# Altium project stm32board.PrjPcb
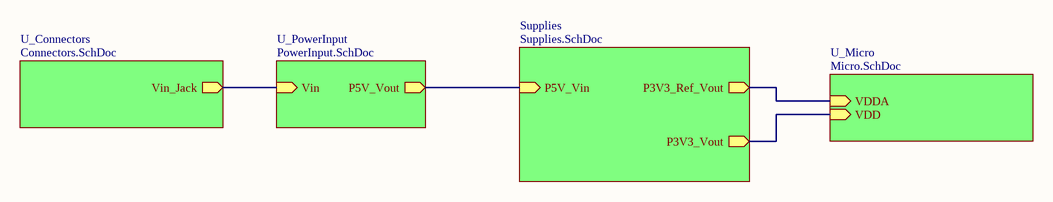
[diagram p0: TopLevel.SchDoc]
5 sheets, 20 parts. Net scope: hierarchical (ports join the sheet entries above them; power ports are global).
Board file: Board_Single.PcbDoc
Sheets:
  TopLevel.SchDoc
    Supplies = Supplies.SchDoc
    U_Micro = Micro.SchDoc
    U_Connectors = Connectors.SchDoc
    U_PowerInput = PowerInput.SchDoc

## Sheet TopLevel.SchDoc
size B; SheetNumber: 1; SheetTotal: 6

### Sub-sheets
Supplies = Supplies.SchDoc: P3V3_Ref_Vout (out), P3V3_Vout (out), P5V_Vin (in)
U_Connectors = Connectors.SchDoc: Vin_Jack (out)
U_Micro = Micro.SchDoc: VDDA (in), VDD (in)
U_PowerInput = PowerInput.SchDoc: P5V_Vout (out), Vin (in)

### Nets
P3V3: sheet Supplies/P3V3_Vout, sheet U_Micro/VDD
P3V3_Ref: sheet Supplies/P3V3_Ref_Vout, sheet U_Micro/VDDA
P5V: sheet Supplies/P5V_Vin, sheet U_PowerInput/P5V_Vout
Vin: sheet U_Connectors/Vin_Jack, sheet U_PowerInput/Vin

## Sheet Supplies.SchDoc
size A; SheetNumber: 2; SheetTotal: 4
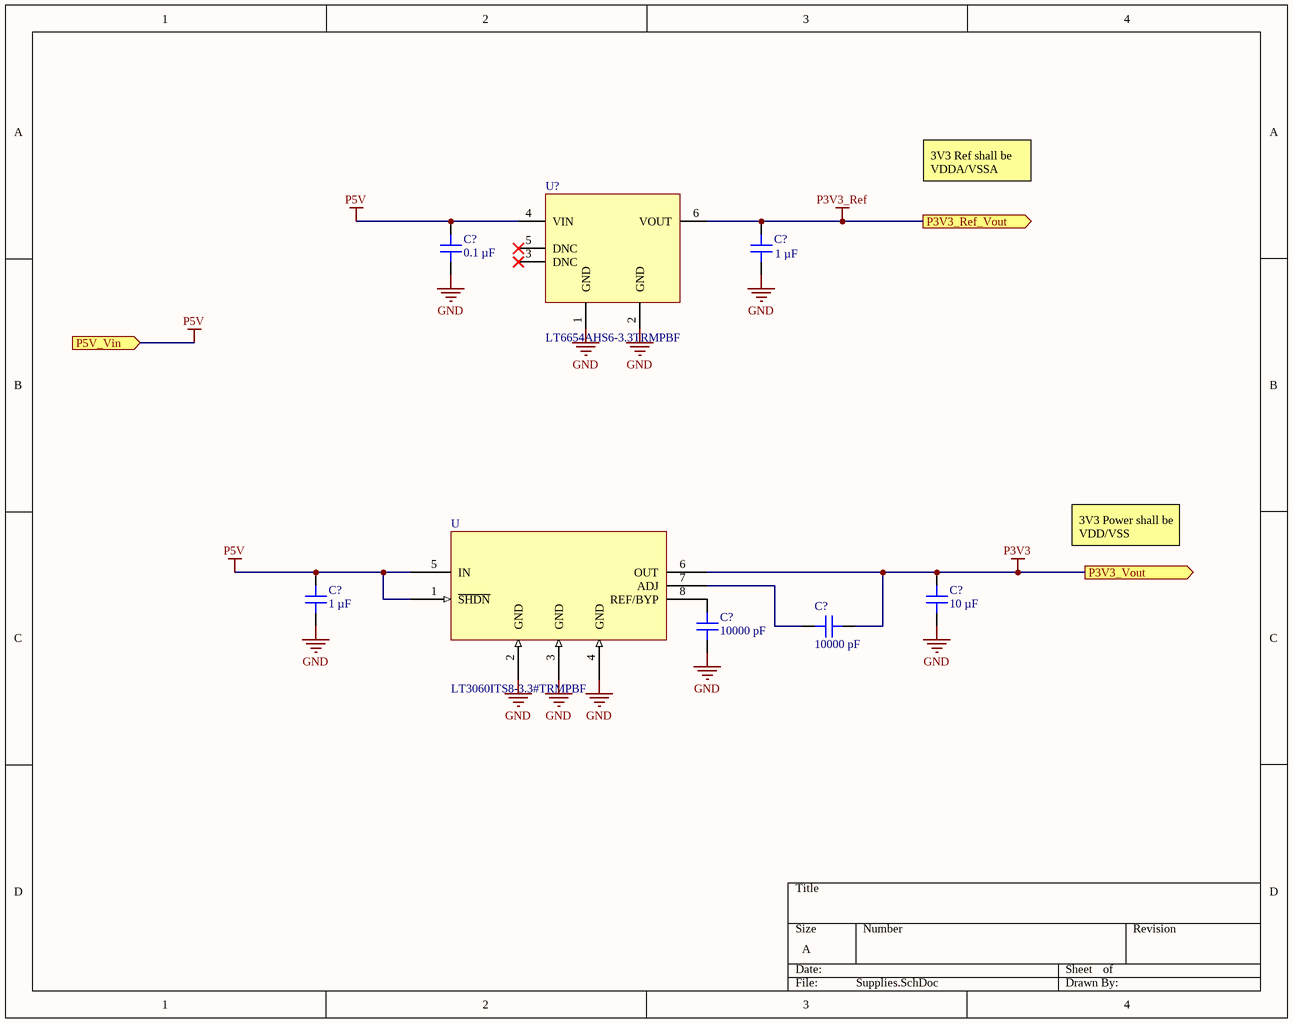
[diagram p1: Supplies.SchDoc]

### Parts
(Parts that share a designator on the sheet are numbered #1, #2 ... from top to bottom, then left to right.)
C?#1  0.1 µF  [CAP 0805_2012]
C?#2  1 µF  [CAP 0805_2012]
C?#3  1 µF  [CAP 0805_2012]
C?#4  10 µF  [CAP 1206_3216 - 0.8MM]
C?#5  10000 pF  [CAP 0805_2012]
C?#6  10000 pF  [CAP 0805_2012]
U  LT3060ITS8-3.3#TRMPBF  [TSOT-23_TS8]
U?  LT6654AHS6-3.3TRMPBF  [SOT95P280X100-6N]

### Ports
P3V3_Ref_Vout (out), P3V3_Vout (out), P5V_Vin (in)

### Nets
GND: C?#1.1 C?#2.1 C?#3.1 C?#4.1 C?#5.1 U.2(GND) U.3(GND) U.4(GND) U?.1(GND) U?.2(GND)
P3V3: C?#4.2 C?#6.1 U.6(OUT) ; port P3V3_Vout
P3V3_Ref: C?#2.2 U?.6(VOUT) ; port P3V3_Ref_Vout
P5V: C?#1.2 C?#3.2 U.1(~{SHDN}) U.5(IN) U?.4(VIN) ; port P5V_Vin
NetC?#5_2: C?#5.2 U.8(REF/BYP)
NetC?#6_2: C?#6.2 U.7(ADJ)

Not connected (* = marked no-connect by the designer): U? 3(DNC)* 5(DNC)*

### Notes on the sheet
- 3V3 Ref shall be VDDA/VSSA
- 3V3 Power shall be VDD/VSS

### Library data of the parts
C?#1 = C0805C104M3RAC7800: CAP CER 0.1UF 25V X7R 0805; manufacturer: KEMET; Tolerance: ±20%; Part Number: C0805C104M3RAC7800; Value: 0.1 µF; Applications: Bypass, Decoupling; Capacitance: 0.1 µF; componentlink1description: Datasheet; componentlink1url: https://api.kemet.com/component-edge/download/datasheet/C0805C104M3RACTU.pdf; componentlink2description: DigiKey Link; componentlink2url: https://www.digikey.com/en/products/detail/kemet/C0805C104M3RAC7800/2211748; Device Package: 0805 (2012 Metric); lastupdated: 8/21/2023 7:11:38 PM; Lifecycle Status: Active; Minimum Order: 1; Mounting Type: Surface Mount, MLCC; Operating Temperature: -55°C ~ 125°C; Package / Case: 0805 (2012 Metric); packaging: TapeAndReel; partid: 32959; Part Status: Active; price: 0.01; series: SMD Comm X7R; Size / Dimension: 0.079" L x 0.049" W (2.00mm x 1.25mm); Supplier 1: DigiKey; Supplier Part Number 1: 399-C0805C104M3RAC7800CT-ND; Temperature Coefficient: X7R; Thickness (Max): 0.035" (0.88mm); Voltage - Rated: 25V
C?#2 C?#3 = C0805C105M3RAC7800: CAP CER 1UF 25V X7R 0805; manufacturer: KEMET; Tolerance: ±20%; Part Number: C0805C105M3RAC7800; Value: 1 µF; Applications: Bypass, Decoupling; Capacitance: 1 µF; componentlink1description: Datasheet; componentlink1url: https://api.kemet.com/component-edge/download/datasheet/C0805C105M3RACTU.pdf; componentlink2description: DigiKey Link; componentlink2url: https://www.digikey.com/en/products/detail/kemet/C0805C105M3RAC7800/2211774; Device Package: 0805 (2012 Metric); lastupdated: 8/21/2023 7:11:38 PM; Lifecycle Status: Active; Minimum Order: 1; Mounting Type: Surface Mount, MLCC; Operating Temperature: -55°C ~ 125°C; Package / Case: 0805 (2012 Metric); packaging: TapeAndReel; partid: 32957; Part Status: Active; price: 0.02; series: SMD Comm X7R; Size / Dimension: 0.079" L x 0.049" W (2.00mm x 1.25mm); Supplier 1: DigiKey; Supplier Part Number 1: 399-C0805C105M3RAC7800CT-ND; Temperature Coefficient: X7R; Thickness (Max): 0.057" (1.45mm); Voltage - Rated: 25V
C?#4 = C1206C106M4RAC7800: CAP CER 10UF 16V X7R 1206; manufacturer: KEMET; Tolerance: ±20%; Part Number: C1206C106M4RAC7800; Value: 10 µF; Applications: Bypass, Decoupling; Capacitance: 10 µF; componentlink1description: Datasheet; componentlink1url: https://connect.kemet.com:7667/gateway/IntelliData-ComponentDocumentation/1.0/download/datasheet/C1206C106M4RACTU; componentlink2description: DigiKey Link; componentlink2url: https://www.digikey.com/en/products/detail/kemet/C1206C106M4RAC7800/1090844; Device Package: 1206 (3216 Metric); lastupdated: 8/21/2023 7:14:59 PM; Lifecycle Status: Active; Minimum Order: 1; Mounting Type: Surface Mount, MLCC; Operating Temperature: -55°C ~ 125°C; Package / Case: 1206 (3216 Metric); packaging: TapeAndReel; partid: 45390; Part Status: Active; price: 0.09; series: SMD Comm X7R; Size / Dimension: 0.126" L x 0.063" W (3.20mm x 1.60mm); Supplier 1: DigiKey; Supplier Part Number 1: 399-C1206C106M4RAC7800CT-ND; Temperature Coefficient: X7R; Thickness (Max): 0.071" (1.80mm); Voltage - Rated: 16V
C?#5 C?#6 = C0805C103M3RAC7800: CAP CER 10000PF 25V X7R 0805; manufacturer: KEMET; Tolerance: ±20%; Part Number: C0805C103M3RAC7800; Value: 10000 pF; Applications: Bypass, Decoupling; Capacitance: 10000 pF; componentlink1description: Datasheet; componentlink1url: https://api.kemet.com/component-edge/download/datasheet/C0805C103M3RACTU.pdf; componentlink2description: DigiKey Link; componentlink2url: https://www.digikey.com/en/products/detail/kemet/C0805C103M3RAC7800/2211730; Device Package: 0805 (2012 Metric); lastupdated: 8/21/2023 7:11:36 PM; Lifecycle Status: Active; Minimum Order: 1; Mounting Type: Surface Mount, MLCC; Operating Temperature: -55°C ~ 125°C; Package / Case: 0805 (2012 Metric); packaging: TapeAndReel; partid: 31983; Part Status: Active; price: 0.02; series: SMD Comm X7R; Size / Dimension: 0.079" L x 0.049" W (2.00mm x 1.25mm); Supplier 1: DigiKey; Supplier Part Number 1: 399-C0805C103M3RAC7800CT-ND; Temperature Coefficient: X7R; Thickness (Max): 0.035" (0.88mm); Voltage - Rated: 25V
U = LT3060ITS8-3.3#TRMPBF: LDO Regulator Pos 0.6V to 44.5V 0.1A Automotive 8-Pin TSOT-23 T/R; MP: LT3060HTS8#TRMPBF; MF: Analog Devices; Arrow_Electronics-Purchase-URL: https://snapeda.com/shop?store=Arrow+Electronics&id=4333210; Value: *; SnapEDA_Link: https://www.snapeda.com/parts/LT3060HTS8%23TRMPBF/Analog%20Devices/view-part/4333210/?ref=snap; Mouser-Purchase-URL: https://snapeda.com/shop?store=Mouser&id=4333210; Price: None; DigiKey-Purchase-URL: https://snapeda.com/shop?store=DigiKey&id=4333210; Package: SOT-23-8 Analog Devices; Availability: Unavailable
U? = LT6654AHS6-3.3TRMPBF: Precision Wide Supply High Output Drive Low Noise Reference; MF: Analog Devices; MP: LT6654AHS6-3.3#TRMPBF; SnapEDA_Link: https://www.snapeda.com/parts/LT6654AHS6-3.3%23TRMPBF/Analog+Devices/view-part/?ref=snap; Package: SOT-6 Analog Devices; Value: *; Check_prices: https://www.snapeda.com/parts/LT6654AHS6-3.3%23TRMPBF/Analog+Devices/view-part/?ref=eda

## Sheet Micro.SchDoc
size A; SheetNumber: 3; SheetTotal: 6
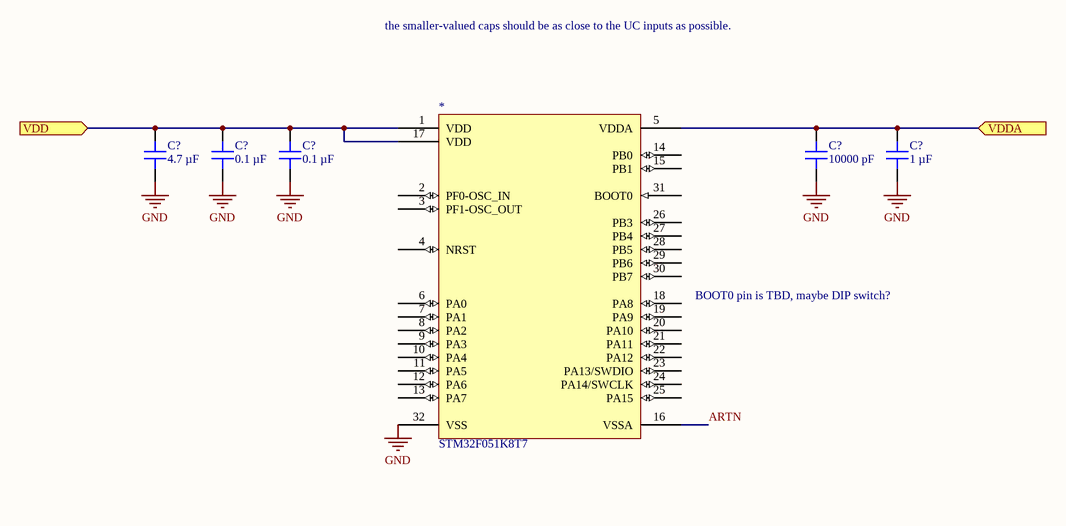
[diagram p2: Micro.SchDoc]

### Parts
(Parts that share a designator on the sheet are numbered #1, #2 ... from top to bottom, then left to right.)
*  STM32F051K8T7  [QFP80P900X900X160-32N]
C?#7  4.7 µF  [CAP 1206_3216 - 0.8MM]
C?#8  0.1 µF  [CAP 0805_2012]
C?#9  0.1 µF  [CAP 0805_2012]
C?#10  10000 pF  [CAP 0805_2012]
C?#11  1 µF  [CAP 0805_2012]

### Ports
VDD (in), VDDA (in)

### Nets
GND: *.32(VSS) C?#7.1 C?#8.1 C?#9.1 C?#10.1 C?#11.1
P3V3: *.1(VDD) *.17(VDD) C?#7.2 C?#8.2 C?#9.2 ; port VDD
P3V3_Ref: *.5(VDDA) C?#10.2 C?#11.2 ; port VDDA
ARTN: *.16(VSSA)

Not connected (* = marked no-connect by the designer): * 2(PF0-OSC_IN) 3(PF1-OSC_OUT) 4(NRST) 6(PA0) 7(PA1) 8(PA2) 9(PA3) 10(PA4) 11(PA5) 12(PA6) 13(PA7) 14(PB0) 15(PB1) 18(PA8) 19(PA9) 20(PA10) 21(PA11) 22(PA12) 23(PA13/SWDIO) 24(PA14/SWCLK) 25(PA15) 26(PB3) 27(PB4) 28(PB5) 29(PB6) 30(PB7) 31(BOOT0)

### Notes on the sheet
- the smaller-valued caps should be as close to the UC inputs as possible.
- BOOT0 pin is TBD, maybe DIP switch?

### Library data of the parts
C?#7 = C1206C475M3RAC7800: CAP CER 4.7UF 25V X7R 1206; manufacturer: KEMET; Tolerance: ±20%; Part Number: C1206C475M3RAC7800; Value: 4.7 µF; Applications: Bypass, Decoupling; Capacitance: 4.7 µF; componentlink1description: Datasheet; componentlink1url: https://api.kemet.com/component-edge/download/datasheet/C1206C475M3RACTU.pdf; componentlink2description: DigiKey Link; componentlink2url: https://www.digikey.com/en/products/detail/kemet/C1206C475M3RAC7800/2215998; Device Package: 1206 (3216 Metric); lastupdated: 8/22/2023 7:13:55 PM; Lifecycle Status: Active; Minimum Order: 1; Mounting Type: Surface Mount, MLCC; Operating Temperature: -55°C ~ 125°C; Package / Case: 1206 (3216 Metric); packaging: TapeAndReel; partid: 30483; Part Status: Active; price: 0.07; series: SMD Comm X7R; Size / Dimension: 0.126" L x 0.063" W (3.20mm x 1.60mm); Supplier 1: DigiKey; Supplier Part Number 1: 399-C1206C475M3RAC7800CT-ND; Temperature Coefficient: X7R; Thickness (Max): 0.071" (1.80mm); Voltage - Rated: 25V
C?#8 C?#9 = C0805C104M3RAC7800: as C?#1 on sheet Supplies; Part Number: C0805C104M3RAC7800; Value: 0.1 µF; Applications: Bypass, Decoupling; Capacitance: 0.1 µF; componentlink1description: Datasheet; componentlink1url: https://api.kemet.com/component-edge/download/datasheet/C0805C104M3RACTU.pdf; componentlink2description: DigiKey Link; componentlink2url: https://www.digikey.com/en/products/detail/kemet/C0805C104M3RAC7800/2211748; Device Package: 0805 (2012 Metric); lastupdated: 8/21/2023 7:11:38 PM; Lifecycle Status: Active; Minimum Order: 1; Mounting Type: Surface Mount, MLCC; Operating Temperature: -55°C ~ 125°C; Package / Case: 0805 (2012 Metric); packaging: TapeAndReel; partid: 32959; Part Status: Active; price: 0.01; series: SMD Comm X7R; Size / Dimension: 0.079" L x 0.049" W (2.00mm x 1.25mm); Supplier 1: DigiKey; Supplier Part Number 1: 399-C0805C104M3RAC7800CT-ND; Temperature Coefficient: X7R; Thickness (Max): 0.035" (0.88mm); Voltage - Rated: 25V
C?#10 = C0805C103M3RAC7800: as C?#5 on sheet Supplies; Part Number: C0805C103M3RAC7800; Value: 10000 pF; Applications: Bypass, Decoupling; Capacitance: 10000 pF; componentlink1description: Datasheet; componentlink1url: https://api.kemet.com/component-edge/download/datasheet/C0805C103M3RACTU.pdf; componentlink2description: DigiKey Link; componentlink2url: https://www.digikey.com/en/products/detail/kemet/C0805C103M3RAC7800/2211730; Device Package: 0805 (2012 Metric); lastupdated: 8/21/2023 7:11:36 PM; Lifecycle Status: Active; Minimum Order: 1; Mounting Type: Surface Mount, MLCC; Operating Temperature: -55°C ~ 125°C; Package / Case: 0805 (2012 Metric); packaging: TapeAndReel; partid: 31983; Part Status: Active; price: 0.02; series: SMD Comm X7R; Size / Dimension: 0.079" L x 0.049" W (2.00mm x 1.25mm); Supplier 1: DigiKey; Supplier Part Number 1: 399-C0805C103M3RAC7800CT-ND; Temperature Coefficient: X7R; Thickness (Max): 0.035" (0.88mm); Voltage - Rated: 25V
C?#11 = C0805C105M3RAC7800: as C?#2 on sheet Supplies; Part Number: C0805C105M3RAC7800; Value: 1 µF; Applications: Bypass, Decoupling; Capacitance: 1 µF; componentlink1description: Datasheet; componentlink1url: https://api.kemet.com/component-edge/download/datasheet/C0805C105M3RACTU.pdf; componentlink2description: DigiKey Link; componentlink2url: https://www.digikey.com/en/products/detail/kemet/C0805C105M3RAC7800/2211774; Device Package: 0805 (2012 Metric); lastupdated: 8/21/2023 7:11:38 PM; Lifecycle Status: Active; Minimum Order: 1; Mounting Type: Surface Mount, MLCC; Operating Temperature: -55°C ~ 125°C; Package / Case: 0805 (2012 Metric); packaging: TapeAndReel; partid: 32957; Part Status: Active; price: 0.02; series: SMD Comm X7R; Size / Dimension: 0.079" L x 0.049" W (2.00mm x 1.25mm); Supplier 1: DigiKey; Supplier Part Number 1: 399-C0805C105M3RAC7800CT-ND; Temperature Coefficient: X7R; Thickness (Max): 0.057" (1.45mm); Voltage - Rated: 25V

## Sheet Connectors.SchDoc
size A; SheetNumber: 4; SheetTotal: 6
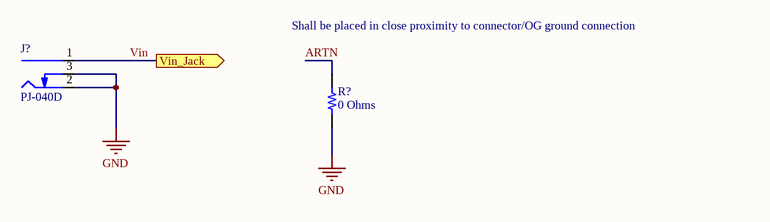
[diagram p3: Connectors.SchDoc]

### Parts
J?  PJ-040D  [CUI PJ-040D]
R?  0 Ohms  [RES 0805_2012]

### Ports
Vin_Jack (out)

### Nets
GND: J?.2(Outer) J?.3(SW) R?.1
ARTN: R?.2
Vin: J?.1(Centre) ; port Vin_Jack

### Notes on the sheet
- Shall be placed in close proximity to connector/OG ground connection

### Library data of the parts
J? = PJ-040D: CONN PWR JACK 1.3X3.4MM SOLDER; Manufacturer: CUI Devices; Actual Diameter: 0.051" (1.30mm ID), 0.150" (3.80mm OD); Current Rating (Amps): 2A; Gender: Male; Industry Recognized Mating Diameter: 1.30mm ID (0.051"), 3.50mm OD (0.138"); Internal Switch(s): Single Switch, Normally Closed; Material Flammability Rating: UL94 V-0; Mating Length/Depth: 0.339" (8.60mm); Number of Positions/Contacts: 2 Conductors, 3 Contacts; Shielding: Unshielded; Voltage - Rated: 24VDC; Part Number: PJ-040D; ComponentLink1Description: Datasheet; ComponentLink1URL: https://www.cuidevices.com/product/resource/digikeypdf/pj-040d.pdf; ComponentLink2Description: DigiKey Link; ComponentLink2URL: //digikey.com/product-detail/en/cui-devices/PJ-040D/CP-040D-ND/1644558; Connector Type: Jack; Features: Board Guide; LastUpdated: 12/16/2019 6:56:22 PM; Lifecycle Status: 0; Minimum Order: 1; Mounting Type: Through Hole, Right Angle; Packaging: Bulk; Part Status: Active; Price: 0.63; Series: -; Supplier 1: DigiKey; Supplier Part Number 1: CP-040D-ND; Termination: Solder
R? = CRCW08050000Z0ECC: RES 0 OHM JUMPER 1/8W 0805; Manufacturer: Vishay Dale; Power (Watts): 0.125W, 1/8W; Part Number: CRCW08050000Z0ECC; Value: 0 Ohms; ComponentLink1Description: Datasheet; ComponentLink1URL: http://www.vishay.com/docs/28773/crcwce3.pdf; ComponentLink2Description: DigiKey Link; ComponentLink2URL: https://www.digikey.com/en/products/detail/vishay-dale/CRCW08050000Z0ECC/7928549; Composition: Thick Film; Device Package: 0805 (2012 Metric); Height - Seated (Max): 0.024" (0.60mm); LastUpdated: 8/22/2023 7:47:38 PM; Lifecycle Status: Active; Minimum Order: 1; Number of Terminations: 2; Operating Temperature: -55°C ~ 155°C; Package / Case: 0805 (2012 Metric); Packaging: CutTape; PartId: 41979; Part Status: Active; Price: 0.01; Resistance: 0 Ohms; Series: CRCW-C; Size / Dimension: 0.079" L x 0.049" W (2.00mm x 1.25mm); Supplier 1: DigiKey; Supplier Part Number 1: 541-4127-1-ND; Supplier Device Package: 0805; Tolerance: Jumper

## Sheet PowerInput.SchDoc
size A; SheetNumber: 5; SheetTotal: 6
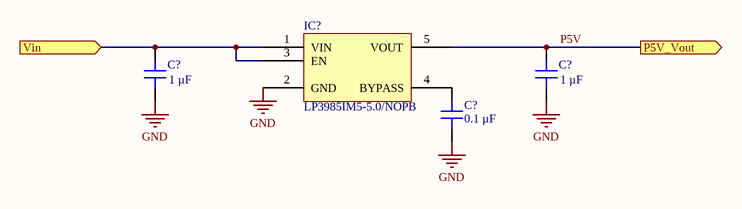
[diagram p4: PowerInput.SchDoc]

### Parts
(Parts that share a designator on the sheet are numbered #1, #2 ... from top to bottom, then left to right.)
C?#12  1 µF  [CAP 0805_2012]
C?#13  1 µF  [CAP 0805_2012]
C?#14  0.1 µF  [CAP 0805_2012]
IC?  LP3985IM5-5.0/NOPB  [TI SOT-23-5 DBV]

### Ports
P5V_Vout (out), Vin (in)

### Nets
GND: C?#12.1 C?#13.1 C?#14.1 IC?.2(GND)
P5V: C?#13.2 IC?.5(VOUT) ; port P5V_Vout
Vin: C?#12.2 IC?.1(VIN) IC?.3(EN) ; port Vin
NetC?#14_2: C?#14.2 IC?.4(BYPASS)

### Library data of the parts
C?#12 C?#13 = C0805C105M3RAC7800: as C?#2 on sheet Supplies; Part Number: C0805C105M3RAC7800; Value: 1 µF; Applications: Bypass, Decoupling; Capacitance: 1 µF; componentlink1description: Datasheet; componentlink1url: https://api.kemet.com/component-edge/download/datasheet/C0805C105M3RACTU.pdf; componentlink2description: DigiKey Link; componentlink2url: https://www.digikey.com/en/products/detail/kemet/C0805C105M3RAC7800/2211774; Device Package: 0805 (2012 Metric); lastupdated: 8/21/2023 7:11:38 PM; Lifecycle Status: Active; Minimum Order: 1; Mounting Type: Surface Mount, MLCC; Operating Temperature: -55°C ~ 125°C; Package / Case: 0805 (2012 Metric); packaging: TapeAndReel; partid: 32957; Part Status: Active; price: 0.02; series: SMD Comm X7R; Size / Dimension: 0.079" L x 0.049" W (2.00mm x 1.25mm); Supplier 1: DigiKey; Supplier Part Number 1: 399-C0805C105M3RAC7800CT-ND; Temperature Coefficient: X7R; Thickness (Max): 0.057" (1.45mm); Voltage - Rated: 25V
C?#14 = C0805C104M3RAC7800: as C?#1 on sheet Supplies; Part Number: C0805C104M3RAC7800; Value: 0.1 µF; Applications: Bypass, Decoupling; Capacitance: 0.1 µF; componentlink1description: Datasheet; componentlink1url: https://api.kemet.com/component-edge/download/datasheet/C0805C104M3RACTU.pdf; componentlink2description: DigiKey Link; componentlink2url: https://www.digikey.com/en/products/detail/kemet/C0805C104M3RAC7800/2211748; Device Package: 0805 (2012 Metric); lastupdated: 8/21/2023 7:11:38 PM; Lifecycle Status: Active; Minimum Order: 1; Mounting Type: Surface Mount, MLCC; Operating Temperature: -55°C ~ 125°C; Package / Case: 0805 (2012 Metric); packaging: TapeAndReel; partid: 32959; Part Status: Active; price: 0.01; series: SMD Comm X7R; Size / Dimension: 0.079" L x 0.049" W (2.00mm x 1.25mm); Supplier 1: DigiKey; Supplier Part Number 1: 399-C0805C104M3RAC7800CT-ND; Temperature Coefficient: X7R; Thickness (Max): 0.035" (0.88mm); Voltage - Rated: 25V
IC? = LP3985IM5-5.0/NOPB: IC REG LINEAR 5V 150MA SOT23-5; Manufacturer: Texas Instruments; Control Features: Enable; Current - Quiescent (Iq): 150 µA; Current - Supply (Max): 250 µA; Number of Regulators: 1; Output Configuration: Positive; Output Type: Fixed; Protection Features: Over Current, Over Temperature, Short Circuit; PSRR: 50dB ~ 40dB (1kHz ~ 10kHz); Voltage Dropout (Max): 0.1V @ 150mA; Voltage - Input (Max): 6V; Part Number: LP3985IM5-5.0/NOPB; ComponentLink1Description: Datasheet; ComponentLink1URL: http://www.ti.com/general/docs/suppproductinfo.tsp?distId=10&gotoUrl=http%3A%2F%2Fwww.ti.com%2Flit%2Fgpn%2Flp3985; ComponentLink2Description: DigiKey Link; ComponentLink2URL: https://www.digikey.com/en/products/detail/texas-instruments/LP3985IM5-5-0-NOPB/483051; Current - Output: 150mA; LastUpdated: 8/22/2023 8:28:20 PM; Lifecycle Status: Active; Minimum Order: 1; Mounting Type: Surface Mount; Operating Temperature: -40°C ~ 125°C; Package / Case: SC-74A, SOT-753; Packaging: TapeAndReel; Part Status: Active; Price: 0.31; Series: -; Supplier 1: DigiKey; Supplier Part Number 1: LP3985IM5-5.0/NOPBCT-ND; Supplier Device Package: SOT-23-5; Voltage - Output (Min/Fixed): 5V

## Nets that join several sheets
GND: Supplies (10 pins), Micro (6 pins), Connectors (J?.2 J?.3 R?.1), PowerInput (C?#12.1 C?#13.1 C?#14.1 IC?.2)
P3V3: Supplies (C?#4.2 C?#6.1 U.6), Micro (5 pins)
P3V3_Ref: Supplies (C?#2.2 U?.6), Micro (*.5 C?#10.2 C?#11.2)
P5V: Supplies (5 pins), PowerInput (C?#13.2 IC?.5)
Vin: Connectors (J?.1), PowerInput (C?#12.2 IC?.1 IC?.3)